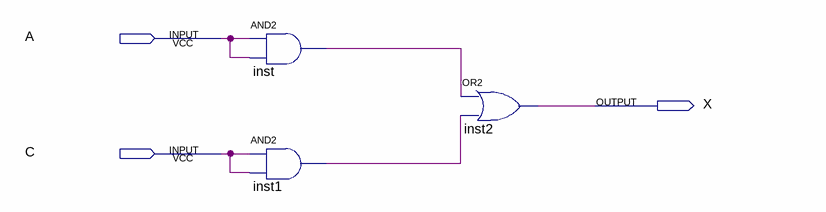
[diagram p0: schematic sheet]
// Quartus schematic Lab_2.bdf as structural Verilog: 3 symbols, 3 pins
module Lab_2 (
  input  A,
  input  C,
  output X
);

  wire inst1_out, inst_out;

  and inst (inst_out, A, A);
  and inst1 (inst1_out, C, C);
  or inst2 (X, inst_out, inst1_out);
endmodule
